# Altium schematic sheet P10 VI Hi3519.SchDoc
size 420 x 297 mm
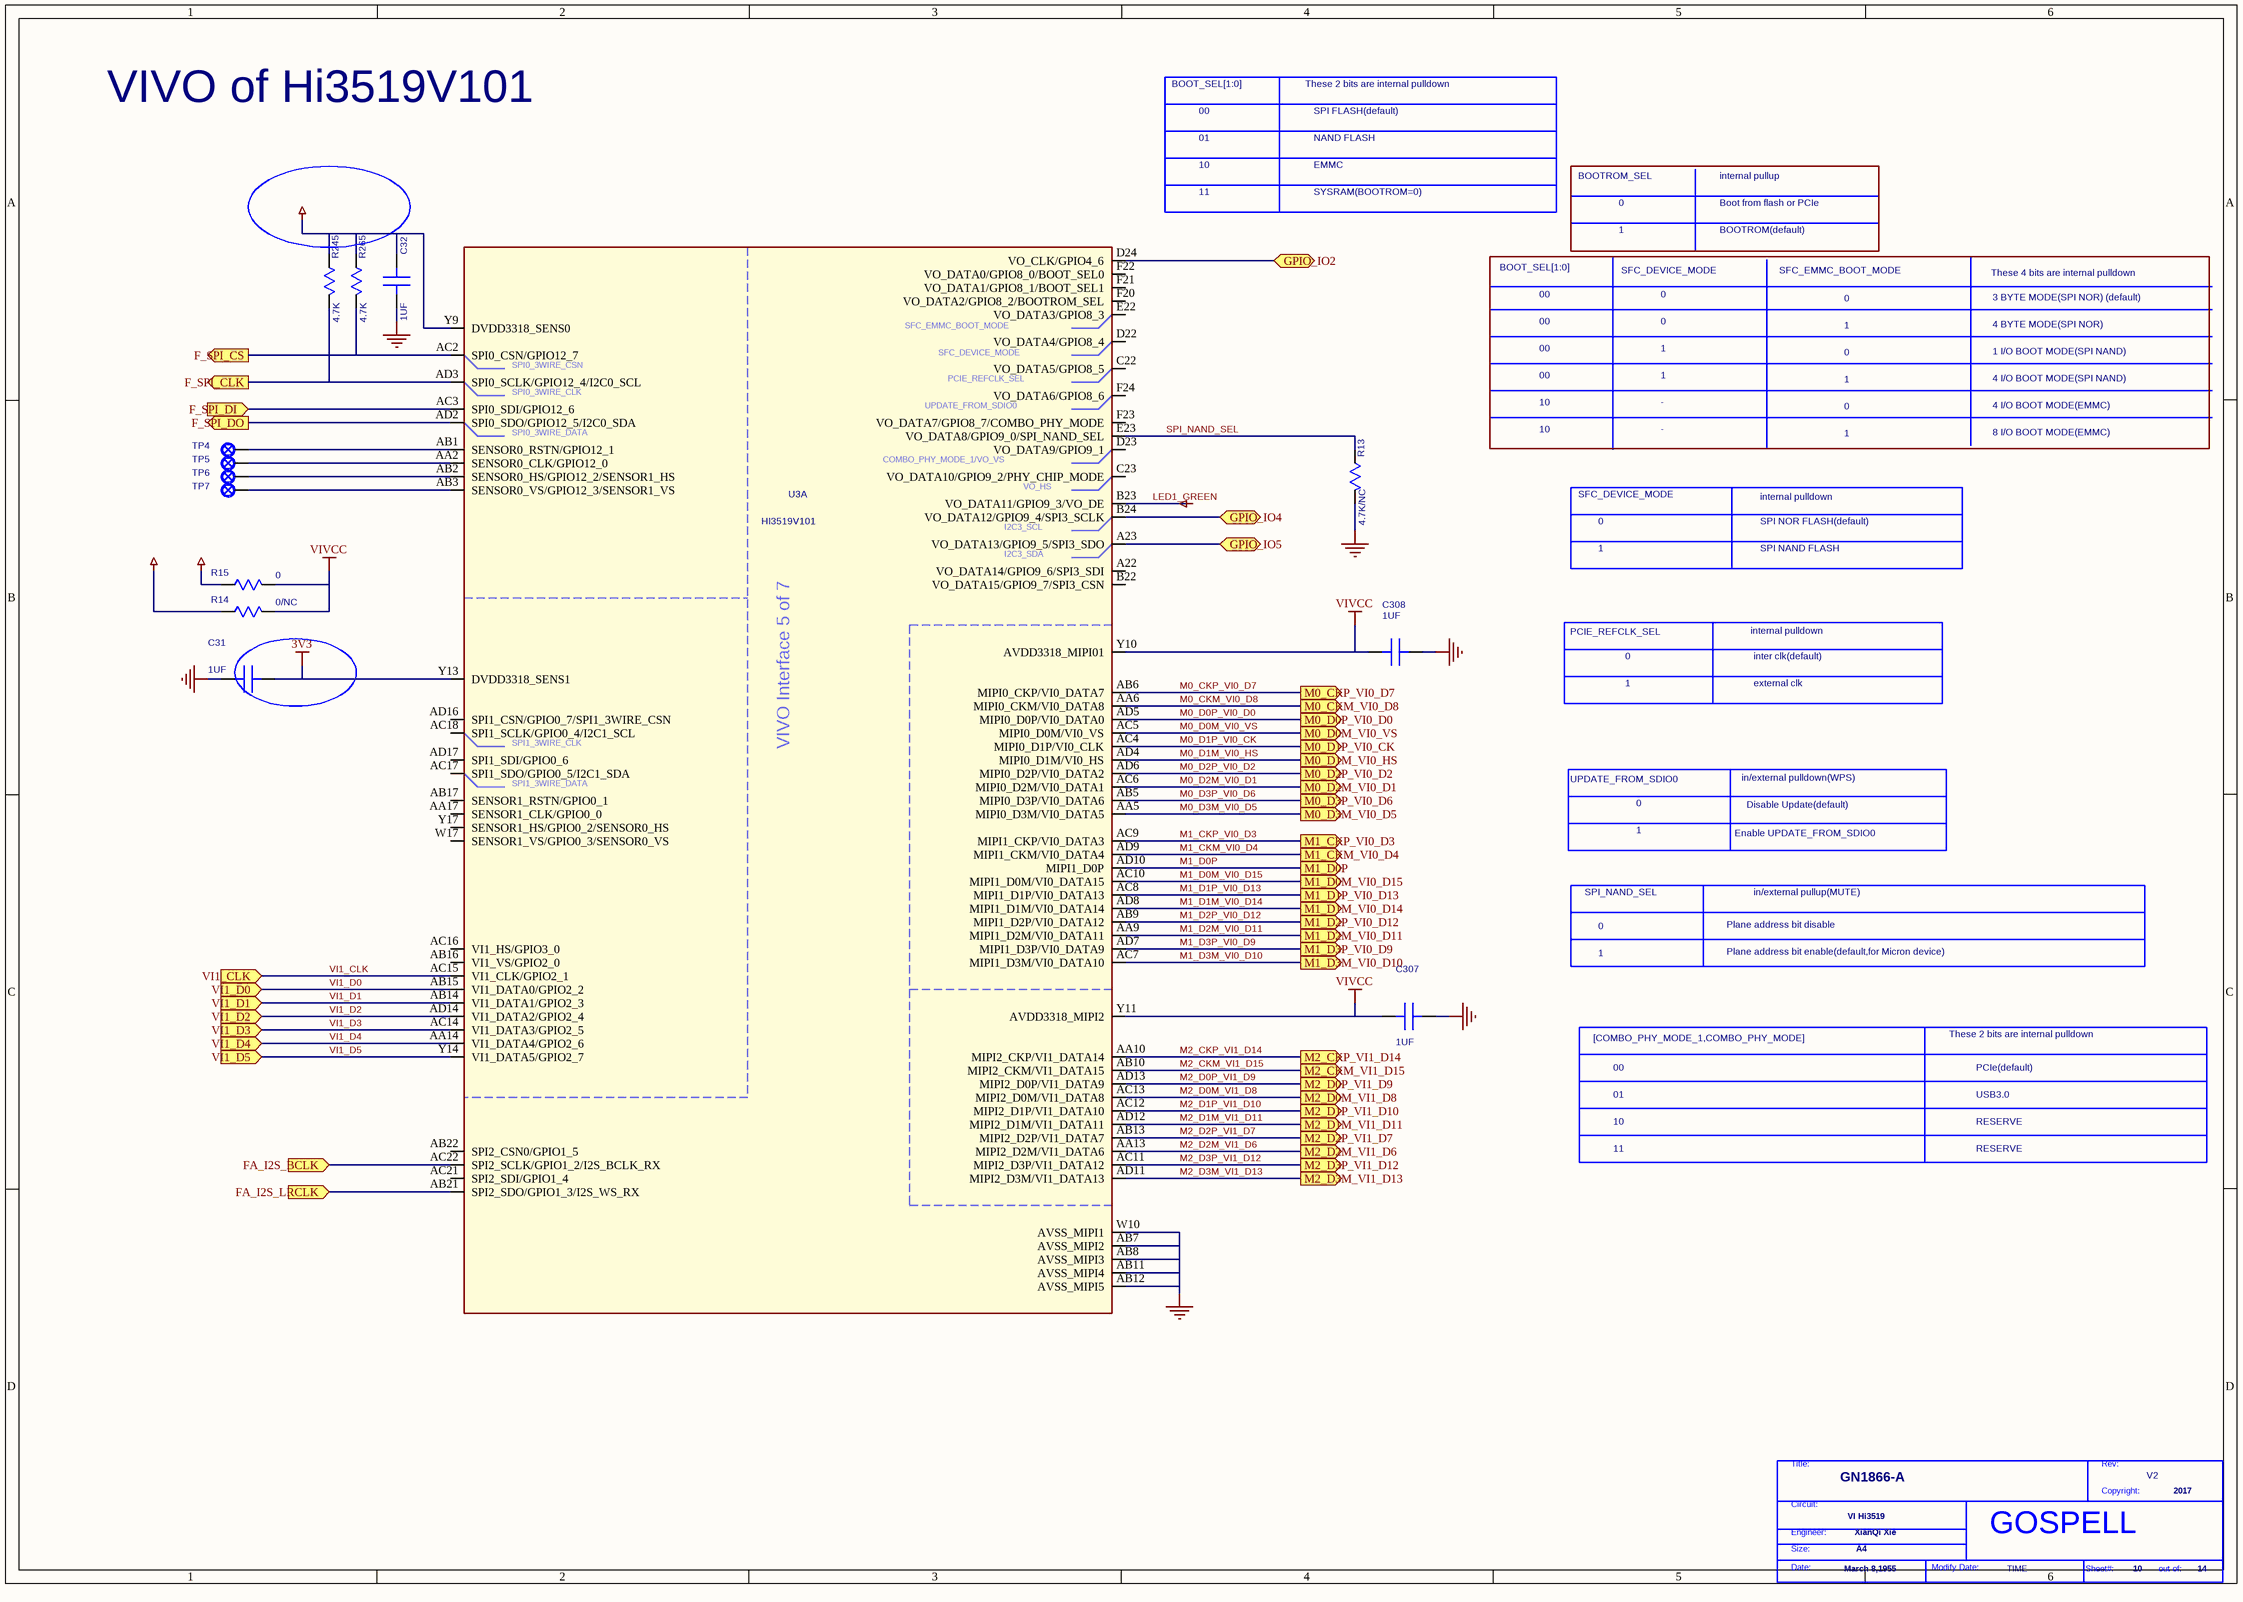
[diagram p0: P10 VI Hi3519.SchDoc]

## Parts
*  Page Modify Date: TIME  Engineer: XianQi Xie  Copyright: 2017  Title: GN1866-A  RevCode: V2  Page Size: A4  Page Create Date: March 8,1955  Page Number: 10  Page Count: 14  Doc: VI Hi3519  (hidden comment: GOSPELL)  (graphical)
C31  1UF  [HSC0201]
C32  1UF  [HSC0201]
C307  1UF  [HSC0201]
C308  1UF  [HSC0201]
R13  4.7K/NC  [SR0402]
R14  0/NC  [SR0402]
R15  0  [SR0402]
R245  4.7K  [SR0402]
R265  4.7K  [SR0402]
TP4  TESTPOINT  [TP24-SMD]  (value not drawn)
TP5  TESTPOINT  [TP24-SMD]  (value not drawn)
TP6  TESTPOINT  [TP24-SMD]  (value not drawn)
TP7  TESTPOINT  [TP24-SMD]  (value not drawn)
U3  DEVICE: HI3519V101  [HBGA524-16-2424]  (hidden comment: HI3519V101_PER)  (part A of 7)

## Ports
F_SPI_CLK (out), F_SPI_CS (out), F_SPI_DI (in), F_SPI_DO (out), FA_I2S_BCLK (in), FA_I2S_LRCLK (in), GPIO_IO2 (bidir), GPIO_IO4 (bidir), GPIO_IO5 (bidir), M0_CKM_VI0_D8 (out), M0_CKP_VI0_D7 (out), M0_D0M_VI0_VS (out), M0_D0P_VI0_D0 (out), M0_D1M_VI0_HS (out), M0_D1P_VI0_CK (out), M0_D2M_VI0_D1 (out), M0_D2P_VI0_D2 (out), M0_D3M_VI0_D5 (out), M0_D3P_VI0_D6 (out), M1_CKM_VI0_D4 (out), M1_CKP_VI0_D3 (out), M1_D0M_VI0_D15 (out), M1_D0P (out), M1_D1M_VI0_D14 (out), M1_D1P_VI0_D13 (out), M1_D2M_VI0_D11 (out), M1_D2P_VI0_D12 (out), M1_D3M_VI0_D10 (out), M1_D3P_VI0_D9 (out), M2_CKM_VI1_D15 (out), M2_CKP_VI1_D14 (out), M2_D0M_VI1_D8 (out), M2_D0P_VI1_D9 (out), M2_D1M_VI1_D11 (out), M2_D1P_VI1_D10 (out), M2_D2M_VI1_D6 (out), M2_D2P_VI1_D7 (out), M2_D3M_VI1_D13 (out), M2_D3P_VI1_D12 (out), VI1_CLK (in), VI1_D0 (in), VI1_D1 (in), VI1_D2 (in), VI1_D3 (in), VI1_D4 (in), VI1_D5 (in)

## Nets
1V8: R14.1(A)
3V3: C31.1(A) C32.1(A) R15.1(A) R245.1(A) R265.1(A) U3.Y9(DVDD3318_SENS0) U3.Y13(DVDD3318_SENS1)
GND: C31.2(B) C32.2(B) C307.2(B) C308.2(B) R13.2(B) U3.AB7(AVSS_MIPI2) U3.AB8(AVSS_MIPI3) U3.AB11(AVSS_MIPI4) U3.AB12(AVSS_MIPI5) U3.W10(AVSS_MIPI1)
LED1_GREEN: U3.B23(VO_DATA11/GPIO9_3/VO_DE)
VIVCC: C307.1(A) C308.1(A) R14.2(B) R15.2(B) U3.Y10(AVDD3318_MIPI01) U3.Y11(AVDD3318_MIPI2)
F_SPI_CLK: R245.2(B) U3.AD3(SPI0_SCLK/GPIO12_4/I2C0_SCL) ; port F_SPI_CLK
F_SPI_CS: R265.2(B) U3.AC2(SPI0_CSN/GPIO12_7) ; port F_SPI_CS
F_SPI_DI: U3.AC3(SPI0_SDI/GPIO12_6) ; port F_SPI_DI
F_SPI_DO: U3.AD2(SPI0_SDO/GPIO12_5/I2C0_SDA) ; port F_SPI_DO
FA_I2S_BCLK: U3.AC22(SPI2_SCLK/GPIO1_2/I2S_BCLK_RX) ; port FA_I2S_BCLK
FA_I2S_LRCLK: U3.AB21(SPI2_SDO/GPIO1_3/I2S_WS_RX) ; port FA_I2S_LRCLK
GPIO_IO2: U3.D24(VO_CLK/GPIO4_6) ; port GPIO_IO2
GPIO_IO4: U3.B24(VO_DATA12/GPIO9_4/SPI3_SCLK) ; port GPIO_IO4
GPIO_IO5: U3.A23(VO_DATA13/GPIO9_5/SPI3_SDO) ; port GPIO_IO5
M0_CKM_VI0_D8: U3.AA6(MIPI0_CKM/VI0_DATA8) ; port M0_CKM_VI0_D8
M0_CKP_VI0_D7: U3.AB6(MIPI0_CKP/VI0_DATA7) ; port M0_CKP_VI0_D7
M0_D0M_VI0_VS: U3.AC5(MIPI0_D0M/VI0_VS) ; port M0_D0M_VI0_VS
M0_D0P_VI0_D0: U3.AD5(MIPI0_D0P/VI0_DATA0) ; port M0_D0P_VI0_D0
M0_D1M_VI0_HS: U3.AD4(MIPI0_D1M/VI0_HS) ; port M0_D1M_VI0_HS
M0_D1P_VI0_CK: U3.AC4(MIPI0_D1P/VI0_CLK) ; port M0_D1P_VI0_CK
M0_D2M_VI0_D1: U3.AC6(MIPI0_D2M/VI0_DATA1) ; port M0_D2M_VI0_D1
M0_D2P_VI0_D2: U3.AD6(MIPI0_D2P/VI0_DATA2) ; port M0_D2P_VI0_D2
M0_D3M_VI0_D5: U3.AA5(MIPI0_D3M/VI0_DATA5) ; port M0_D3M_VI0_D5
M0_D3P_VI0_D6: U3.AB5(MIPI0_D3P/VI0_DATA6) ; port M0_D3P_VI0_D6
M1_CKM_VI0_D4: U3.AD9(MIPI1_CKM/VI0_DATA4) ; port M1_CKM_VI0_D4
M1_CKP_VI0_D3: U3.AC9(MIPI1_CKP/VI0_DATA3) ; port M1_CKP_VI0_D3
M1_D0M_VI0_D15: U3.AC10(MIPI1_D0M/VI0_DATA15) ; port M1_D0M_VI0_D15
M1_D0P: U3.AD10(MIPI1_D0P) ; port M1_D0P
M1_D1M_VI0_D14: U3.AD8(MIPI1_D1M/VI0_DATA14) ; port M1_D1M_VI0_D14
M1_D1P_VI0_D13: U3.AC8(MIPI1_D1P/VI0_DATA13) ; port M1_D1P_VI0_D13
M1_D2M_VI0_D11: U3.AA9(MIPI1_D2M/VI0_DATA11) ; port M1_D2M_VI0_D11
M1_D2P_VI0_D12: U3.AB9(MIPI1_D2P/VI0_DATA12) ; port M1_D2P_VI0_D12
M1_D3M_VI0_D10: U3.AC7(MIPI1_D3M/VI0_DATA10) ; port M1_D3M_VI0_D10
M1_D3P_VI0_D9: U3.AD7(MIPI1_D3P/VI0_DATA9) ; port M1_D3P_VI0_D9
M2_CKM_VI1_D15: U3.AB10(MIPI2_CKM/VI1_DATA15) ; port M2_CKM_VI1_D15
M2_CKP_VI1_D14: U3.AA10(MIPI2_CKP/VI1_DATA14) ; port M2_CKP_VI1_D14
M2_D0M_VI1_D8: U3.AC13(MIPI2_D0M/VI1_DATA8) ; port M2_D0M_VI1_D8
M2_D0P_VI1_D9: U3.AD13(MIPI2_D0P/VI1_DATA9) ; port M2_D0P_VI1_D9
M2_D1M_VI1_D11: U3.AD12(MIPI2_D1M/VI1_DATA11) ; port M2_D1M_VI1_D11
M2_D1P_VI1_D10: U3.AC12(MIPI2_D1P/VI1_DATA10) ; port M2_D1P_VI1_D10
M2_D2M_VI1_D6: U3.AA13(MIPI2_D2M/VI1_DATA6) ; port M2_D2M_VI1_D6
M2_D2P_VI1_D7: U3.AB13(MIPI2_D2P/VI1_DATA7) ; port M2_D2P_VI1_D7
M2_D3M_VI1_D13: U3.AD11(MIPI2_D3M/VI1_DATA13) ; port M2_D3M_VI1_D13
M2_D3P_VI1_D12: U3.AC11(MIPI2_D3P/VI1_DATA12) ; port M2_D3P_VI1_D12
SPI_NAND_SEL: R13.1(A) U3.E23(VO_DATA8/GPIO9_0/SPI_NAND_SEL)
VI1_CLK: U3.AC15(VI1_CLK/GPIO2_1) ; port VI1_CLK
VI1_D0: U3.AB15(VI1_DATA0/GPIO2_2) ; port VI1_D0
VI1_D1: U3.AB14(VI1_DATA1/GPIO2_3) ; port VI1_D1
VI1_D2: U3.AD14(VI1_DATA2/GPIO2_4) ; port VI1_D2
VI1_D3: U3.AC14(VI1_DATA3/GPIO2_5) ; port VI1_D3
VI1_D4: U3.AA14(VI1_DATA4/GPIO2_6) ; port VI1_D4
VI1_D5: U3.Y14(VI1_DATA5/GPIO2_7) ; port VI1_D5
NetTP4_1: TP4.1 U3.AB1(SENSOR0_RSTN/GPIO12_1)
NetTP5_1: TP5.1 U3.AA2(SENSOR0_CLK/GPIO12_0)
NetTP6_1: TP6.1 U3.AB2(SENSOR0_HS/GPIO12_2/SENSOR1_HS)
NetTP7_1: TP7.1 U3.AB3(SENSOR0_VS/GPIO12_3/SENSOR1_VS)

Not connected (* = marked no-connect by the designer): U3 A22(VO_DATA14/GPIO9_6/SPI3_SDI) AA17(SENSOR1_CLK/GPIO0_0) AB16(VI1_VS/GPIO2_0) AB17(SENSOR1_RSTN/GPIO0_1) AB22(SPI2_CSN0/GPIO1_5) AC16(VI1_HS/GPIO3_0) AC17(SPI1_SDO/GPIO0_5/I2C1_SDA) AC18(SPI1_SCLK/GPIO0_4/I2C1_SCL) AC21(SPI2_SDI/GPIO1_4) AD16(SPI1_CSN/GPIO0_7/SPI1_3WIRE_CSN) AD17(SPI1_SDI/GPIO0_6) B22(VO_DATA15/GPIO9_7/SPI3_CSN) C22(VO_DATA5/GPIO8_5) C23(VO_DATA10/GPIO9_2/PHY_CHIP_MODE) D22(VO_DATA4/GPIO8_4) D23(VO_DATA9/GPIO9_1) E22(VO_DATA3/GPIO8_3) F20(VO_DATA2/GPIO8_2/BOOTROM_SEL) F21(VO_DATA1/GPIO8_1/BOOT_SEL1) F22(VO_DATA0/GPIO8_0/BOOT_SEL0) F23(VO_DATA7/GPIO8_7/COMBO_PHY_MODE) F24(VO_DATA6/GPIO8_6) W17(SENSOR1_VS/GPIO0_3/SENSOR0_VS) Y17(SENSOR1_HS/GPIO0_2/SENSOR0_HS)

## Notes on the sheet
- VIVO of Hi3519V101
- BOOT_SEL[1:0]
- 00
- These 2 bits are internal pulldown
- SPI FLASH(default)
- 01
- 10
- 11
- SYSRAM(BOOTROM=0)
- EMMC
- NAND FLASH
- BOOTROM_SEL
- internal pullup
- 1
- 0
- BOOTROM(default)
- Boot from flash or PCIe
- SFC_DEVICE_MODE
- SFC_EMMC_BOOT_MODE
- These 4 bits are internal pulldown
- 4 BYTE MODE(SPI NOR)
- 3 BYTE MODE(SPI NOR) (default)
- 4 I/O BOOT MODE(SPI NAND)
- 1 I/O BOOT MODE(SPI NAND)
- -
- 8 I/O BOOT MODE(EMMC)
- 4 I/O BOOT MODE(EMMC)
- internal pulldown
- SPI NOR FLASH(default)
- SPI NAND FLASH
- PCIE_REFCLK_SEL
- inter clk(default)
- external clk
- UPDATE_FROM_SDIO0
- in/external pulldown(WPS)
- Enable UPDATE_FROM_SDIO0
- Disable Update(default)
- SPI_NAND_SEL
- Plane address bit disable
- in/external pullup(MUTE)
- Plane address bit enable(default,for Micron device)
- [COMBO_PHY_MODE_1,COMBO_PHY_MODE]
- PCIe(default)
- USB3.0
- RESERVE
- (in symbol GOSPELL) Title:; Rev:; Copyright:; Circuit:; Engineer:; Size:; Date:; Modify Date:; Sheet#:; out of:
- (in symbol HI3519V101_PER_2, part A) SFC_EMMC_BOOT_MODE; SFC_DEVICE_MODE; SPI0_3WIRE_CSN; PCIE_REFCLK_SEL; SPI0_3WIRE_CLK; UPDATE_FROM_SDIO0; SPI0_3WIRE_DATA; COMBO_PHY_MODE_1/VO_VS; VO_HS; I2C3_SCL; I2C3_SDA; SPI1_3WIRE_CLK; VIVO Interface 5 of 7; SPI1_3WIRE_DATA

## Library data of the parts
C31 C32 = C_0_Dup2: PARTS: 1; OriginalSymbolOrigin: (0,30); DEVICE: CM03X5R105M06AH_A; LEVEL: STD; PINSWAP: (A,B); CODE: 8071128; %195%%232%%202%%246%: SMD陶瓷电容-4V-1000NF-+/-20%-X5R-0201(0.65MM*0.35MM*0.35MM)-终端专用; %182%%238%%182%%168%%185%%164%%215%%247%%181%%231%%209%%185%(V): 6.3; COMPONENT_HIGH_MAX: 0.35MM; %208%%161%%192%%224%%195%%251%%179%%198%: SMD陶瓷电容; GVALUE: C  4V  1uF +80%~-20%  X5R 0201(0.65MM*0.35MM*0.35MM); PKG_TYPE: HSC0201
C307 = C_0_Dup2: PARTS: 1; OriginalSymbolOrigin: (0,30); DEVICE: CM03X5R105M06AH_A; LEVEL: STD; PINSWAP: (A,B); CODE: 8071128; %195%%232%%202%%246%: SMD陶瓷电容-4V-1000NF-+/-20%-X5R-0201(0.65MM*0.35MM*0.35MM)-终端专用; %182%%238%%182%%168%%185%%164%%215%%247%%181%%231%%209%%185%(V): 10; COMPONENT_HIGH_MAX: 0.35MM; %208%%161%%192%%224%%195%%251%%179%%198%: SMD陶瓷电容; GVALUE: C  4V  1uF +80%~-20%  X5R 0201(0.65MM*0.35MM*0.35MM); PKG_TYPE: HSC0201
C308 = C_0_Dup2: PARTS: 1; OriginalSymbolOrigin: (0,30); DEVICE: CM03X5R105M06AH_A; LEVEL: STD; PINSWAP: (A,B); %208%%161%%192%%224%%195%%251%%179%%198%: SMD陶瓷电容; COMPONENT_HIGH_MAX: 0.35MM; %182%%238%%182%%168%%185%%164%%215%%247%%181%%231%%209%%185%(V): 10; %195%%232%%202%%246%: SMD陶瓷电容-4V-1000NF-+/-20%-X5R-0201(0.65MM*0.35MM*0.35MM)-终端专用; CODE: 8071128; GVALUE: C  4V  1uF +80%~-20%  X5R 0201(0.65MM*0.35MM*0.35MM); PKG_TYPE: HSC0201
R13 = R_0: PARTS: 1; OriginalSymbolOrigin: (10,20); PINSWAP: (A,B); DEVICE: RK73B1ELTP472J; LEVEL: STD; CODE: 7090793; %195%%232%%202%%246%: 片式厚膜电阻器-0.0625W-4700OHM-+/-5%-0402-BT; %182%%238%%182%%168%%185%%166%%194%%202%(W): 0.06; %215%%232%%214%%181%%212%%202%%208%%237%%198%%171%%178%%238%: +/-5%; COMPONENT_HIGH_MAX: 0.4MM; %208%%161%%192%%224%%195%%251%%179%%198%: 片式厚膜电阻器; GVALUE: NC; PKG_TYPE: SR0402
R14 = R_0: PARTS: 1; OriginalSymbolOrigin: (10,20); PINSWAP: (A,B); DEVICE: RC0402JR_070R; LEVEL: STD; %208%%161%%192%%224%%195%%251%%179%%198%: 片式厚膜电阻器; COMPONENT_HIGH_MAX: 0.4MM; %215%%232%%214%%181%%212%%202%%208%%237%%198%%171%%178%%238%: < 50MOHM; %182%%238%%182%%168%%185%%166%%194%%202%(W): 0.06; %195%%232%%202%%246%: 片式厚膜电阻器-0.0625W-0OHM-< 50MOHM-0402-1A-BT; CODE: 7090800; GVALUE: NC; PKG_TYPE: SR0402
R15 = R_0: PARTS: 1; OriginalSymbolOrigin: (10,20); PINSWAP: (A,B); DEVICE: RC0402JR_070R; LEVEL: STD; %208%%161%%192%%224%%195%%251%%179%%198%: 片式厚膜电阻器; COMPONENT_HIGH_MAX: 0.4MM; %215%%232%%214%%181%%212%%202%%208%%237%%198%%171%%178%%238%: < 50MOHM; %182%%238%%182%%168%%185%%166%%194%%202%(W): 0.06; %195%%232%%202%%246%: 片式厚膜电阻器-0.0625W-0OHM-< 50MOHM-0402-1A-BT; CODE: 7090800; GVALUE: R 1/16W 0±5% 0402; PKG_TYPE: SR0402
R245 R265 = R_0: PARTS: 1; OriginalSymbolOrigin: (10,20); PINSWAP: (A,B); DEVICE: RK73B1ELTP472J; LEVEL: STD; CODE: 7090793; %195%%232%%202%%246%: 片式厚膜电阻器-0.0625W-4700OHM-+/-5%-0402-BT; %182%%238%%182%%168%%185%%166%%194%%202%(W): 0.06; %215%%232%%214%%181%%212%%202%%208%%237%%198%%171%%178%%238%: +/-5%; COMPONENT_HIGH_MAX: 0.4MM; %208%%161%%192%%224%%195%%251%%179%%198%: 片式厚膜电阻器; GVALUE: R 1/16W 4.7K±5% 0402; PKG_TYPE: SR0402
TP4-TP7 = TESTPOINT_0: PARTS: 1; OriginalSymbolOrigin: (20,20); LEVEL: STD; DEVICE: TEST-SMD; GVALUE: NC; PKG_TYPE: TP24-SMD
U3 = HI3519V101_PER_2: PARTS: 1; OriginalSymbolOrigin: (0,840); LEVEL: STD; HETERO: (HI3519V101_PWR),(HI3519V101_DDR),(HI3519V101_SYS),(HI3519V101_VIVO),(HI3519V101_PER),(HI3519V101_VSS1),(HI3519V101_VSS2); CODE: G01428016_MODZH; %195%%232%%202%%246%: 请注意是HDI板，建库的时候请注意下-02323838; COMPONENT_HIGH_MAX: 0.98MM; CaptureCellPackProp: HI3519V101_PERA; FORWARD_PCB: 1; PKG_TYPE: HBGA524-16-2424; GVALUE: HI3519V101_PER
* = GOSPELL: Cage Code: 2017